# EAGLE design TCC_COMPLETO_02 (EAGLE 4.16)
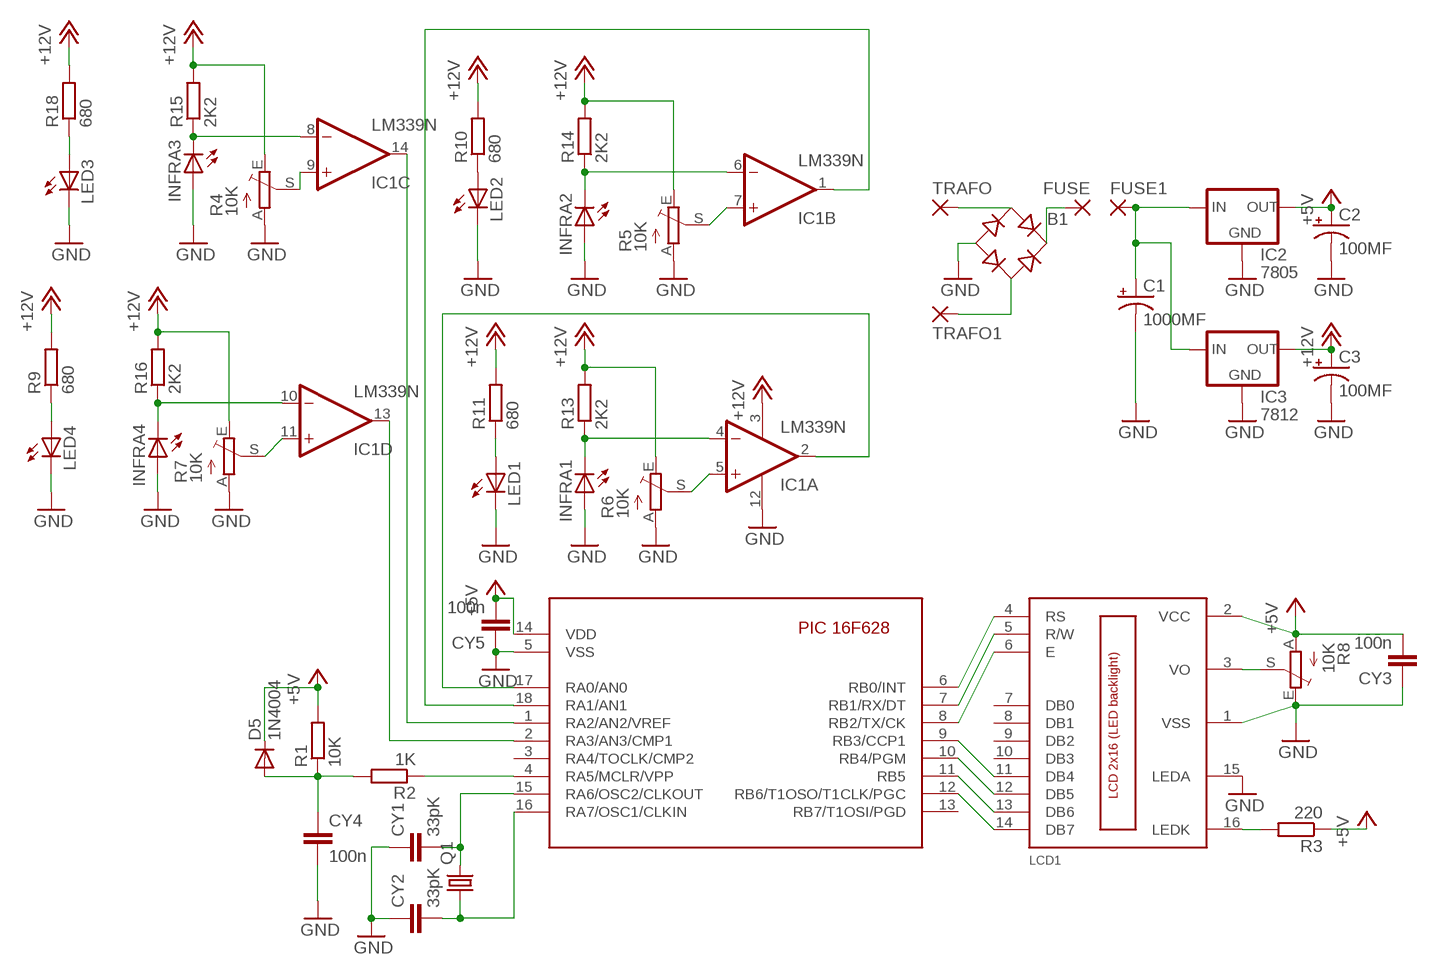
[diagram p0: schematic, sheet 1]

## Parts
B1  RB1A  [RB1A]
C1  1000MF  CPOL-USE5-10.5  [E5-10,5]
C2  100MF  CPOL-USE5-8.5  [E5-8,5]
C3  100MF  CPOL-USE5-8.5  [E5-8,5]
CY1  33pK  CYYC7B5  [YC7B5]
CY2  33pK  CYYC7B5  [YC7B5]
CY3  100n  CYYC7B5  [YC7B5]
CY4  100n  CYYC7B5  [YC7B5]
CY5  100n  CYYC7B5  [YC7B5]
D5  1N4004  [DO41-10]
FUSE  2,54/1,0  [2,54/1,0]
FUSE1  2,54/1,0  [2,54/1,0]
IC1  LM339N  [DIL14]
IC2  7805  78XXS  [78XXS]
IC3  7812  78XXS  [78XXS]
INFRA1  LED5MM  [LED5MM]
INFRA2  LED5MM  [LED5MM]
INFRA3  LED5MM  [LED5MM]
INFRA4  LED5MM  [LED5MM]
LCD1  LCD_2X16  [HY-1602F]
LED1  LED5MM  [LED5MM]
LED2  LED5MM  [LED5MM]
LED3  LED5MM  [LED5MM]
LED4  LED5MM  [LED5MM]
Q1  CRYSTALHC49S  [HC49/S]
R1  10K  R-EU_0207/10  [0207/10]
R2  1K  R-EU_0207/10  [0207/10]
R3  220  R-EU_0207/10  [0207/10]
R4  10K  TRIM_EU-LI10  [LI10]
R5  10K  TRIM_EU-LI10  [LI10]
R6  10K  TRIM_EU-LI10  [LI10]
R7  10K  TRIM_EU-LI10  [LI10]
R8  10K  TRIM_EU-LI10  [LI10]
R9  680  R-EU_0309/12  [0309/12]
R10  680  R-EU_0309/12  [0309/12]
R11  680  R-EU_0309/12  [0309/12]
R13  2K2  R-EU_0207/10  [0207/10]
R14  2K2  R-EU_0207/10  [0207/10]
R15  2K2  R-EU_0207/10  [0207/10]
R16  2K2  R-EU_0207/10  [0207/10]
R18  680  R-EU_0309/12  [0309/12]
TRAFO  2,54/1,0  [2,54/1,0]
TRAFO1  2,54/1,0  [2,54/1,0]
U$1  16F628  [PIC16F628-18-LEAD-PDIP]

## Nets
+5V: C2.+ CY3.2 CY5.2 D5.C IC2.OUT LCD1.2(VCC) R1.2 R3.1 R8.A U$1.14(VDD)
+12V: C3.+ IC1.3(P:V+) IC3.OUT R4.E R5.E R6.E R7.E R9.2 R10.2 R11.2 R13.2 R14.2 R15.2 R16.2 R18.2
GND: B1.- C1.- C2.- C3.- CY1.1 CY2.1 CY3.1 CY4.2 CY5.1 IC1.12(P:GND) IC2.GND IC3.GND INFRA1.A INFRA2.A INFRA3.A INFRA4.A LCD1.1(VSS) LCD1.15(LEDA) LED1.K(C) LED2.K(C) LED3.K(C) LED4.K(C) R4.A R5.A R6.A R7.A R8.E U$1.5(VSS)
N$1: CY1.2 Q1.2 U$1.15(RA6/OSC2/CLKOUT)
N$2: CY2.2 Q1.1 U$1.16(RA7/OSC1/CLKIN)
N$3: CY4.1 D5.A R1.1 R2.2
N$4: LCD1.13(DB6) U$1.11(RB5)
N$5: R2.1 U$1.4(RA5/MCLR/VPP)
N$6: LCD1.4(RS) U$1.6(RB0/INT)
N$7: IC1.5(A:+IN) R6.S
N$8: LCD1.5(R/W) U$1.7(RB1/RX/DT)
N$9: LCD1.6(E) U$1.8(RB2/TX/CK)
N$10: LCD1.14(DB7) U$1.12(RB6/T1OSO/T1CLK/PGC)
N$11: LCD1.11(DB4) U$1.9(RB3/CCP1)
N$12: LCD1.12(DB5) U$1.10(RB4/PGM)
N$13: LCD1.3(VO) R8.S
N$14: IC1.7(B:+IN) R5.S
N$15: LCD1.16(LEDK) R3.2
N$16: IC1.11(D:+IN) R7.S
N$17: IC1.9(C:+IN) R4.S
N$18: LED1.A R11.1
N$19: LED2.A R10.1
N$20: LED3.A R18.1
N$21: LED4.A R9.1
N$22: IC1.4(A:-IN) INFRA1.K(C) R13.1
N$23: IC1.8(C:-IN) INFRA3.K(C) R15.1
N$24: IC1.10(D:-IN) INFRA4.K(C) R16.1
N$26: IC1.2(A:OUT) U$1.17(RA0/AN0)
N$27: B1.AC1 TRAFO.1(P)
N$28: C1.+ FUSE1.1(P) IC2.IN IC3.IN
N$29: B1.AC2 TRAFO1.1(P)
N$30: B1.+ FUSE.1(P)
N$31: IC1.1(B:OUT) U$1.18(RA1/AN1)
N$32: IC1.14(C:OUT) U$1.1(RA2/AN2/VREF)
N$33: IC1.13(D:OUT) U$1.2(RA3/AN3/CMP1)
N$34: IC1.6(B:-IN) INFRA2.K(C) R14.1
Unconnected: LCD1.7(DB0) LCD1.8(DB1) LCD1.9(DB2) LCD1.10(DB3) U$1.3(RA4/TOCLK/CMP2) U$1.13(RB7/T1OSI/PGD)

## Library data of the parts
B1 = rectifier:RB1A: RECTIFIER 1 A
C1-C3 = rcl:CPOL-US: POLARIZED CAPACITOR, American symbol
CY1-CY5 = rcl:CY: Y CAPACITOR for power line
D5 = diode:1N4004: DIODE general purpose rectifier, 1 A
FUSE FUSE1 TRAFO TRAFO1 = wirepad:2,54/1,0: THROUGH-HOLE PAD
IC1 = linear:LM339: Low Power Low Offset Voltage Quad Comparators with open collector; LM139/LM239/LM339/LM2901/LM3302
IC2 IC3 = v-reg:78XXS: VOLTAGE REGULATOR
INFRA1-INFRA4 LED1-LED4 = led:LED: LED OSRAM: - CHIPLED LG R971, LG N971, LY N971, LG Q971, LY Q971, LO R971, LY R971 LH N974, LH R974 LS Q976, LO Q976, LY Q976 LO Q996 - Hyper CHIPLED LW Q18S LB Q993, LB Q99A, LB R99A - SideLED LS A670, LO A670, LY A670, LG A670, LP A670 LB A673, LV A673, LT A673, LW A673 LH A674 LY A675 LS A676, LA A676, LO A676, LY A676, LW A676 LS A679, LY A679, LG A679 - Hyper Micro SIDELED® LS Y876, LA Y876, LO Y876, LY Y876 LT Y87S - SmartLED LW L88C, LW L88S LB L89C, LB L89S, LG L890 LS L89K, LO L89K, LY L89K LS L896, LA L896, LO L896, LY L896 - TOPLED LS T670, LO T670, LY T670, LG T670, LP T670 LSG T670, LSP T670, LSY T670, LOP T670, LYG T670 LG T671, LOG T671, LSG T671 LB T673, LV T673, LT T673, LW T673 LH T674 LS T676, LA T676, LO T676, LY T676, LB T676, LH T676, LSB T676, LW T676 LB T67C, LV T67C, LT T67C, LS T67K, LO T67K, LY T67K, LW E67C LS E67B, LA E67B, LO E67B, LY E67B, LB E67C, LV E67C, LT E67C LW T67C LS T679, LY T679, LG T679 LS T770, LO T770, LY T770, LG T770, LP T770 LB T773, LV T773, LT T773, LW T773 LH T774 LS E675, LA E675, LY E675, LS T675 LS T776, LA T776, LO T776, LY T776, LB T776 LHGB T686 LT T68C, LB T68C - Hyper Mini TOPLED® LB M676 - Mini TOPLED Santana® LG M470 LS M47K, LO M47K, LY M47K Source: http://www.osram.convergy.de - LUMILED® LXK2-PW12-R00, LXK2-PW12-S00, LXK2-PW14-U00, LXK2-PW14-V00 LXK2-PM12-R00, LXK2-PM12-S00, LXK2-PM14-U00 LXK2-PE12-Q00, LXK2-PE12-R00, LXK2-PE12-S00, LXK2-PE14-T00, LXK2-PE14-U00 LXK2-PB12-K00, LXK2-PB12-L00, LXK2-PB12-M00, LXK2-PB14-N00, LXK2-PB14-P00, LXK2-PB14-Q00 LXK2-PR12-L00, LXK2-PR12-M00, LXK2-PR14-Q00, LXK2-PR14-R00 LXK2-PD12-Q00, LXK2-PD12-R00, LXK2-PD12-S00 LXK2-PH12-R00, LXK2-PH12-S00 LXK2-PL12-P00, LXK2-PL12-Q00, LXK2-PL12-R00 Source: www.luxeon.com
LCD1 = lcd_2x16_led_backlight:LCD_2X16
Q1 = crystal:CRYSTAL: CRYSTAL
R1-R3 R9-R11 R13-R16 R18 = rcl:R-EU_: RESISTOR, European symbol
R4-R8 = pot:TRIM_EU-: POTENTIOMETER
U$1 = pic16f6xx-1:16F628: Microchip component PIC 16F628 Eric Magraner - eric_magraner@yahoo.fr 03/2004

## Board
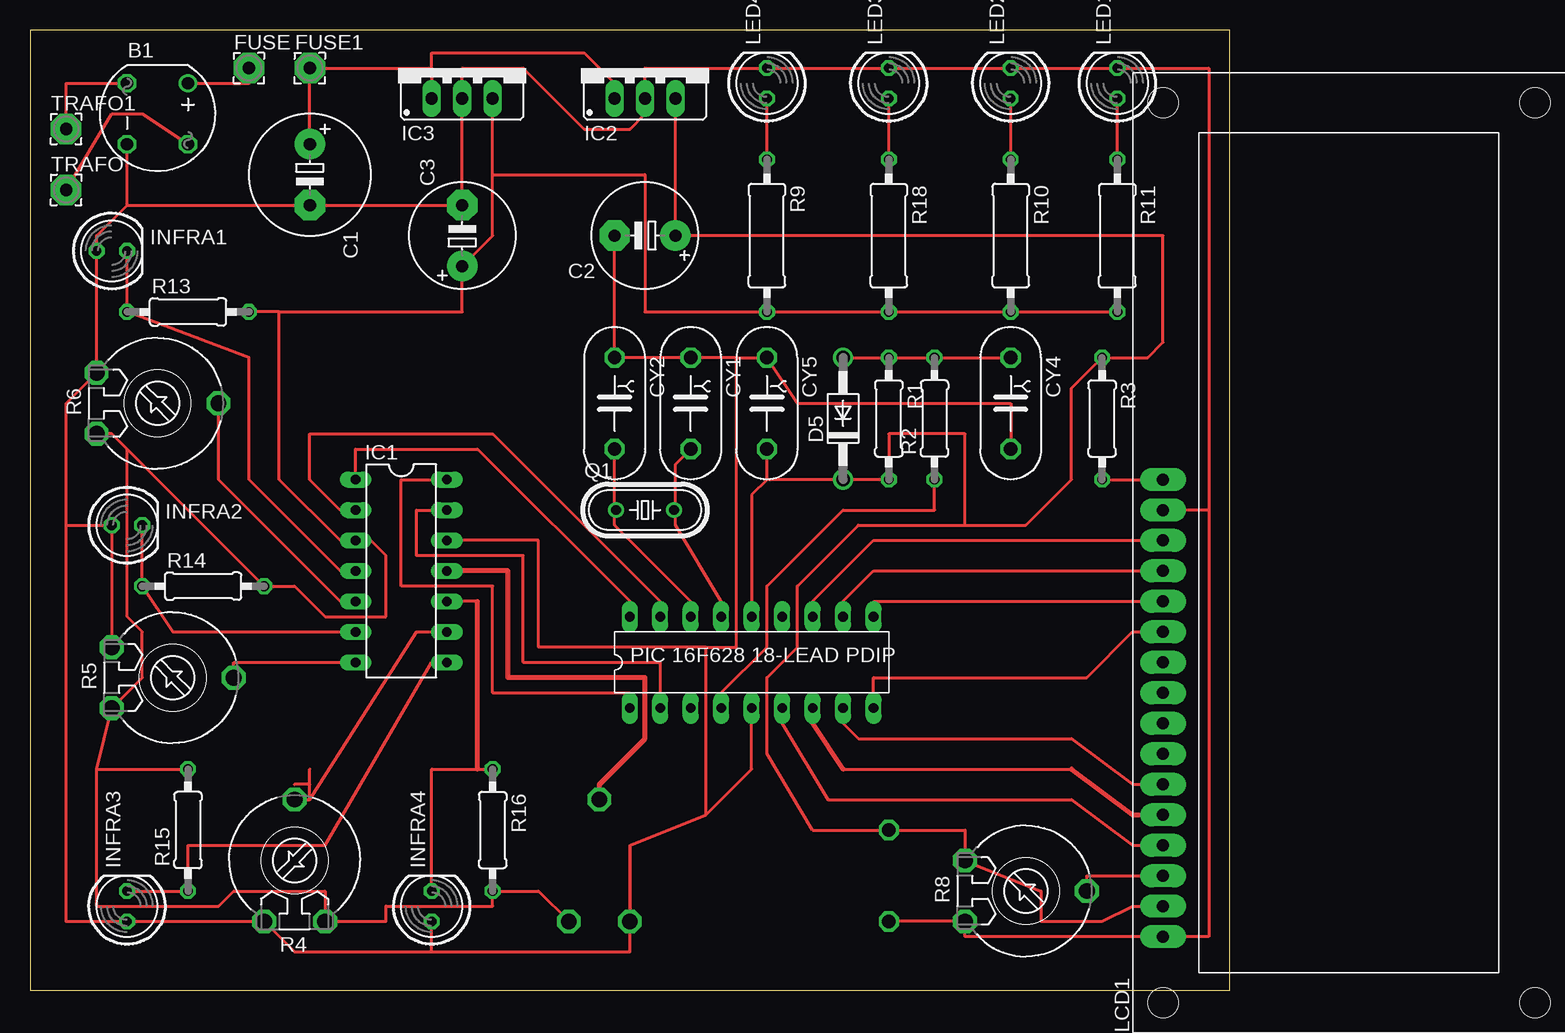
[diagram p1: board, top side]
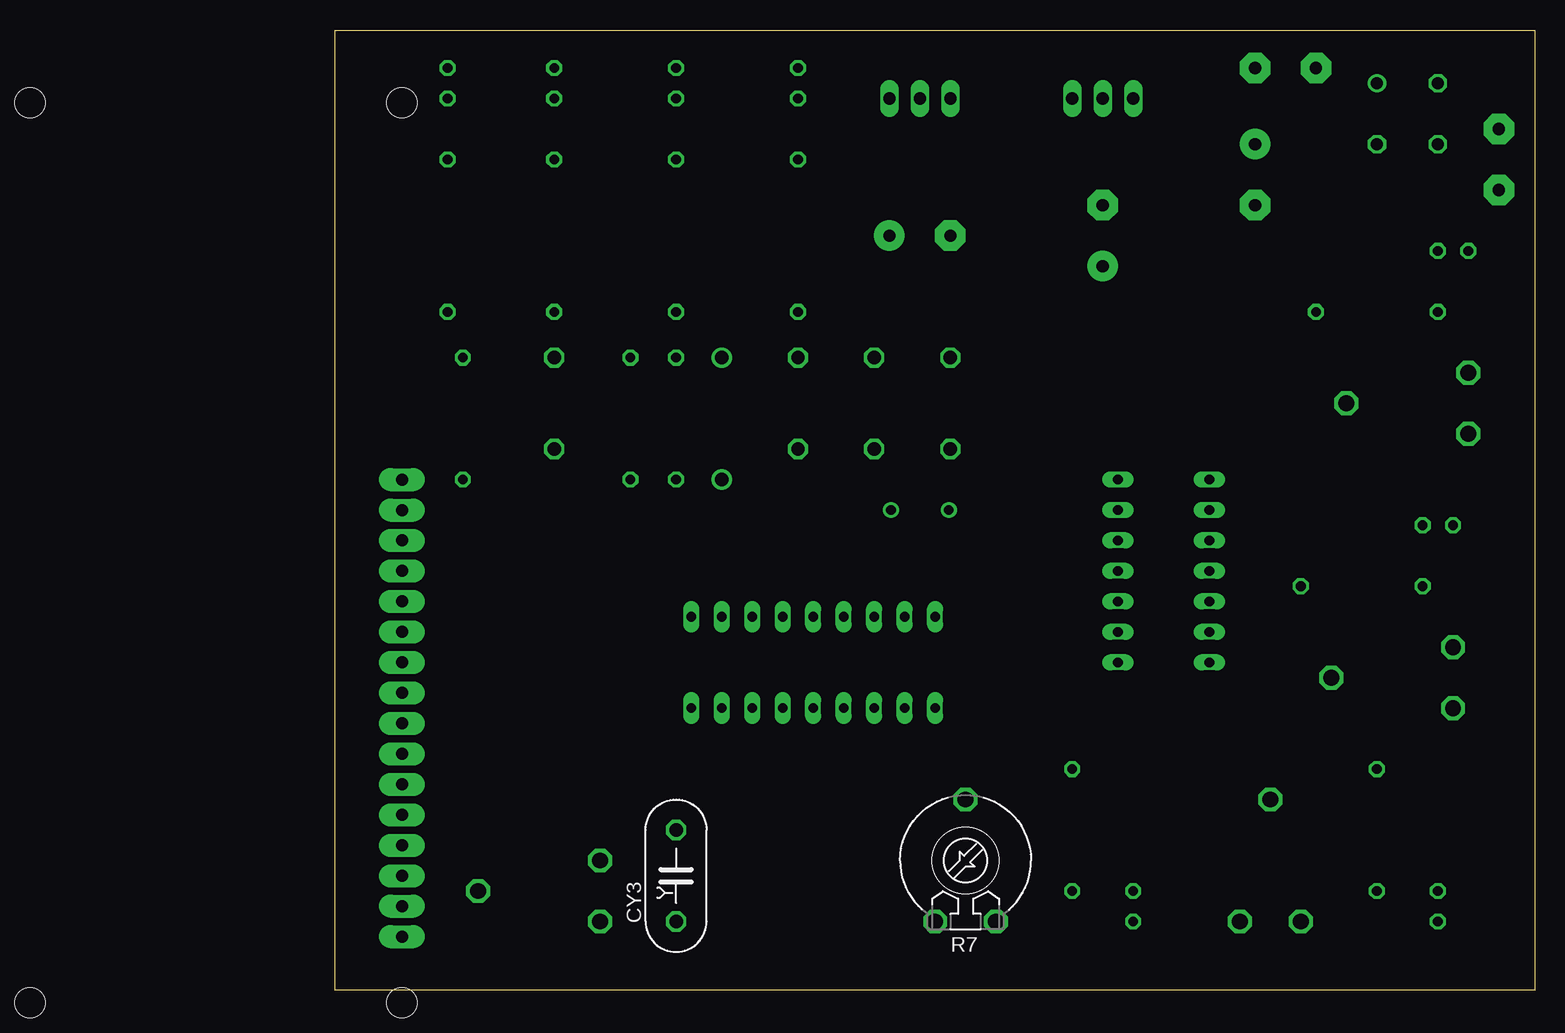
[diagram p2: board, bottom side, seen from below]

Size 100 x 80 mm. Coordinates in mm from the lower left corner, seen from the top.
Outline: 0,0 100,0 100,80 0,80 0,0
Copper layers (1*2): Top 0.035mm / dielectric 1.5mm / layer 2 0mm
Design rules "default": minimum track width 10mil, minimum drill 24mil, track to track 8mil, track to pad 8mil, pad to pad 8mil, via to via 8mil, smd to smd 8mil, copper to edge 40mil, drill to drill 8mil, minimum pad ring 10mil, minimum via ring 8mil, stop-mask expansion 4mil, vias tented up to drill 0mil, thermal gap 10mil

### Footprints (pad centres in the part's own frame; a part is rotated, then mirrored left to right if it is on the bottom)
RB1A = drill 1.016 round: + -2.54,2.54 | drill 1.016 octagon: - 2.54,-2.54; AC1 2.54,2.54; AC2 -2.54,-2.54
E5-10,5 = drill 1.016 pad 2.54 round: + -2.54,0 | drill 1.016 pad 2.54 octagon: - 2.54,0
E5-8,5 = drill 1.016 pad 2.54 round: + -2.54,0 | drill 1.016 pad 2.54 octagon: - 2.54,0
YC7B5 = drill 1.118 octagon: 1 -3.81,0; 2 3.81,0
DO41-10 = drill 1.118 round: A 5.08,0; C -5.08,0
2,54/1,0 = drill 1.016 pad 2.54 octagon: 1 0,0
DIL14 = drill 0.813 long: 1 -7.62,-3.81; 2 -5.08,-3.81; 3 -2.54,-3.81; 4 0,-3.81; 5 2.54,-3.81; 6 5.08,-3.81; 7 7.62,-3.81; 8 7.62,3.81; 9 5.08,3.81; 10 2.54,3.81; 11 0,3.81; 12 -2.54,3.81; 13 -5.08,3.81; 14 -7.62,3.81
78XXS = drill 1.016 long: GND 0,-2.54; IN -2.54,-2.54; OUT 2.54,-2.54
LED5MM = drill 0.813 octagon: A -1.27,0; K 1.27,0
HY-1602F = drill 1 pad 1.93 long: 1 2.54,0; 2 5.08,0; 3 7.62,0; 4 10.16,0; 5 12.7,0; 6 15.24,0; 7 17.78,0; 8 20.32,0; 9 22.86,0; 10 25.4,0; 11 27.94,0; 12 30.48,0; 13 33.02,0; 14 35.56,0; 15 38.1,0; 16 40.64,0 | hole 2.5: -2.96,0; 72.04,0; -2.96,-31; 72.04,-31
HC49/S = drill 0.813 round: 1 -2.413,0; 2 2.413,0
0207/10 = drill 0.813 octagon: 1 -5.08,0; 2 5.08,0
LI10 = drill 1.321 octagon: A -2.54,-5.08; E 2.54,-5.08; S 0,5.08
0309/12 = drill 0.813 octagon: 1 -6.35,0; 2 6.35,0
PIC16F628-18-LEAD-PDIP = drill 0.813 long: 1 -10.16,-3.81; 2 -7.62,-3.81; 3 -5.08,-3.81; 4 -2.54,-3.81; 5 0,-3.81; 6 2.54,-3.81; 7 5.08,-3.81; 8 7.62,-3.81; 9 10.16,-3.81; 10 10.16,3.81; 11 7.62,3.81; 12 5.08,3.81; 13 2.54,3.81; 14 0,3.81; 15 -2.54,3.81; 16 -5.08,3.81; 17 -7.62,3.81; 18 -10.16,3.81

### Placement (x,y rotation side)
B1  10.63,73.02 270 top
C1  23.33,67.94 270 top
C2  51.27,62.86 180 top
C3  36.03,62.86 90 top
CY1  55.08,48.89 270 top
CY2  48.73,48.89 270 top
CY3  71.59,9.52 90 bottom
CY4  81.75,48.89 270 top
CY5  61.43,48.89 270 top
D5  67.78,47.62 90 top
FUSE  18.25,76.83 0 top
FUSE1  23.33,76.83 0 top
IC1  30.95,34.92 270 top
IC2  51.27,76.83 0 top
IC3  36.03,76.83 0 top
INFRA1  6.82,61.59 0 top
INFRA2  8.09,38.73 0 top
INFRA3  8.09,6.98 90 top
INFRA4  33.49,6.98 90 top
LCD1  94.45,1.9 90 top
LED1  90.64,75.56 90 top
LED2  81.75,75.56 90 top
LED3  71.59,75.56 90 top
LED4  61.43,75.56 90 top
Q1  51.27,40 0 top
R1  71.59,47.62 270 top
R2  75.4,47.62 90 top
R3  89.37,47.62 270 top
R4  22.06,10.79 0 top
R5  11.9,26.03 270 top
R6  10.63,48.89 270 top
R7  47.46,10.79 0 bottom
R8  83.02,8.25 270 top
R9  61.43,62.86 270 top
R10  81.75,62.86 270 top
R11  90.64,62.86 270 top
R13  13.17,56.51 0 top
R14  14.44,33.65 0 top
R15  13.17,13.33 90 top
R16  38.57,13.33 270 top
R18  71.59,62.86 270 top
TRAFO  3.01,66.67 0 top
TRAFO1  3.01,71.75 0 top
U$1  60.16,27.3 0 top

### Tracks (layer width: path | path; a pad name or v marks a point on that pad's centre or on a via)
+5V
  Top 0.254: LCD1.2 91.91,6.98 89.37,5.71 84.29,5.71 84.29,8.25 R8.A 77.94,13.33 CY3.2 65.24,13.33 61.43,19.68 61.43,26.03 63.97,28.57 63.97,33.65 69.05,38.73 77.94,38.73 | IC2.OUT C2.+ 94.45,62.86 94.45,53.97 93.18,52.7 R3.1 86.83,50.16 86.83,42.54 83.02,38.73 77.94,38.73 | 61.43,42.54 CY5.2 | U$1.14 60.16,41.27 61.43,42.54 | 61.43,42.54 D5.C R1.2 71.59,46.35 77.94,46.35 77.94,38.73
+12V
  Top 0.254: R7.E 42.38,8.25 R16.2 38.57,6.98 29.68,6.98 29.68,5.71 R4.E 24.6,8.25 16.98,8.25 15.71,6.98 5.55,6.98 5.55,18.41 | 5.55,18.41 R15.2 | 5.55,18.41 R5.E 9.36,26.03 9.36,29.84 8.09,31.11 8.09,45.08 | 8.09,45.08 6.82,46.35 R6.E | 8.09,45.08 R14.2 22.06,33.65 24.6,31.11 29.68,31.11 29.68,36.19 28.41,37.46 IC1.3 25.87,37.46 20.79,42.54 20.79,56.51 | R11.2 R10.2 R18.2 R9.2 51.27,56.51 51.27,67.94 38.57,67.94 | 20.79,56.51 36.03,56.51 C3.+ 38.57,62.86 38.57,67.94 | 20.79,56.51 R13.2 | 38.57,67.94 IC3.OUT
GND
  Top 0.254: CY3.1 R8.E 77.94,4.44 LCD1.1 98.26,4.44 98.26,40 | 98.26,40 LCD1.15 | 98.26,40 98.26,76.83 LED1.K LED2.K LED3.K LED4.K 51.27,76.83 IC2.GND 51.27,73.02 50,71.75 46.19,71.75 41.11,76.83 36.03,76.83 IC3.GND C3.- C1.- 8.09,65.4 | R5.A INFRA2.A 3.01,38.73 | 8.09,65.4 B1.- | 8.09,65.4 5.55,62.86 INFRA1.A R6.A 3.01,48.89 3.01,38.73 | 3.01,38.73 3.01,5.71 INFRA3.A R4.A 22.06,3.17 33.49,3.17 | 58.89,52.7 CY1.1 CY2.1 C2.- | 58.89,52.7 CY5.1 63.97,48.89 81.75,48.89 CY4.2 | 33.49,3.17 INFRA4.A | 50,3.17 50,12.06 | 50,12.06 R7.A 50,3.17 | 50,12.06 56.35,14.6 | 56.35,14.6 60.16,18.41 U$1.5 | 56.35,28.57 42.38,28.57 42.38,37.46 IC1.12 | 56.35,14.6 56.35,28.57 | 58.89,52.7 58.89,28.57 56.35,28.57 | 33.49,3.17 50,3.17
N$1
  Top 0.254: 53.81,40 53.81,38.73 57.62,32.38 U$1.15 | CY1.2 53.81,43.81 53.81,40 | 53.81,40 Q1.2
N$2
  Top 0.254: 48.73,40 CY2.2 | 48.73,40 48.73,38.73 55.08,32.38 U$1.16 | 48.73,40 Q1.1
N$3
  Top 0.254: D5.A R1.1 R2.2 CY4.1
N$4
  Top 0.254: U$1.11 67.78,32.38 70.32,34.92 LCD1.13
N$5
  Top 0.254: R2.1 75.4,40 67.78,40 61.43,33.65 61.43,28.57 57.62,24.76 U$1.4
N$6
  Top 0.254: U$1.6 62.7,22.22 66.51,15.87 86.83,15.87 91.91,12.06 LCD1.4
N$7
  Top 0.254: R6.S 15.71,42.54 25.87,32.38 IC1.5
N$8
  Top 0.254: 67.78,18.41 86.83,18.41
  Top 0.406: 86.83,18.41 91.91,14.6 LCD1.5 | U$1.7 65.24,22.22 67.78,18.41
N$9
  Top 0.254: U$1.8 67.78,22.22 69.05,20.95 86.83,20.95 91.91,17.14 LCD1.6
N$10
  Top 0.254: U$1.12 65.24,32.38 70.32,37.46 LCD1.14
N$11
  Top 0.254: U$1.9 70.32,26.03 88.1,26.03 91.91,29.84 LCD1.11
N$12
  Top 0.254: U$1.10 70.32,32.38 LCD1.12
N$13
  Top 0.254: R8.S 88.1,9.52 LCD1.3
N$14
  Top 0.254: R5.S 16.98,27.3 IC1.7
N$15
  Top 0.254: R3.2 LCD1.16
N$16
  Top 0.406: IC1.11 39.84,34.92 39.84,26.03 51.27,26.03 51.27,20.95 47.46,17.14 R7.S
N$17
  Top 0.254: 23.33,17.14 23.33,18.41 | 23.33,15.87 32.22,29.84 IC1.9 | R4.S 23.33,15.87 | 23.33,15.87 23.33,17.14 | 23.33,17.14 22.06,17.14
N$18
  Top 0.254: R11.1 LED1.A
N$19
  Top 0.254: R10.1 LED2.A
N$20
  Top 0.254: R18.1 LED3.A
N$21
  Top 0.254: R9.1 LED4.A
N$22
  Top 0.254: INFRA1.K R13.1 18.25,52.7 18.25,42.54 25.87,34.92 IC1.4
N$23
  Top 0.254: INFRA3.K R15.1 13.17,12.06 24.6,12.06 33.49,27.3 IC1.8
N$24
  Top 0.254: INFRA4.K 33.49,18.41 37.3,18.41 R16.1 | 37.3,32.38 IC1.10
  Top 0.406: 37.3,18.41 37.3,32.38
N$26
  Top 0.254: IC1.2 25.87,40 23.33,42.54 23.33,46.35 38.57,46.35 52.54,32.38 U$1.17
N$27
  Top 0.254: B1.AC1 9.36,73.02 6.82,73.02 TRAFO.1
N$28
  Top 0.254: 33.49,76.83 FUSE1.1 C1.+ | 33.49,76.83 33.49,78.1 46.19,78.1 48.73,75.56 IC2.IN | 33.49,76.83 IC3.IN
N$29
  Top 0.254: B1.AC2 3.01,75.56 TRAFO1.1
N$30
  Top 0.254: B1.+ 18.25,75.56 FUSE.1
N$31
  Top 0.254: U$1.18 50,32.38 37.3,45.08 27.14,45.08 IC1.1
N$32
  Top 0.254: U$1.1 50,24.76 38.57,24.76 38.57,33.65 30.95,33.65 30.95,42.54 IC1.14
N$33
  Top 0.254: IC1.13 32.22,40 32.22,36.19 41.11,36.19 41.11,27.3 52.54,27.3 U$1.2
N$34
  Top 0.254: INFRA2.K R14.1 11.9,29.84 IC1.6